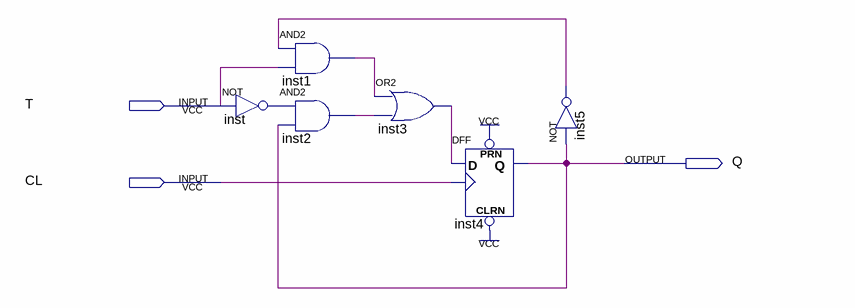
[diagram p0: schematic sheet]
// Quartus schematic problem2.bdf as structural Verilog: 6 symbols, 3 pins
module problem2 (
  input  T,
  input  CL,
  output Q
);

  wire inst1_out, inst2_out, inst3_out, inst5_out, inst_out;

  not inst (inst_out, T);
  and inst1 (inst1_out, inst5_out, T);
  and inst2 (inst2_out, inst_out, Q);
  or inst3 (inst3_out, inst1_out, inst2_out);
  DFF inst4 (.CLRN(1'b1), .CLK(CL), .D(inst3_out), .PRN(1'b1), .Q(Q));
  not inst5 (inst5_out, Q);
endmodule
